# Altium schematic sheet HEADERSchDoc.SchDoc: HEADER
size 420 x 297 mm; SheetNumber: 3; SheetTotal: 11
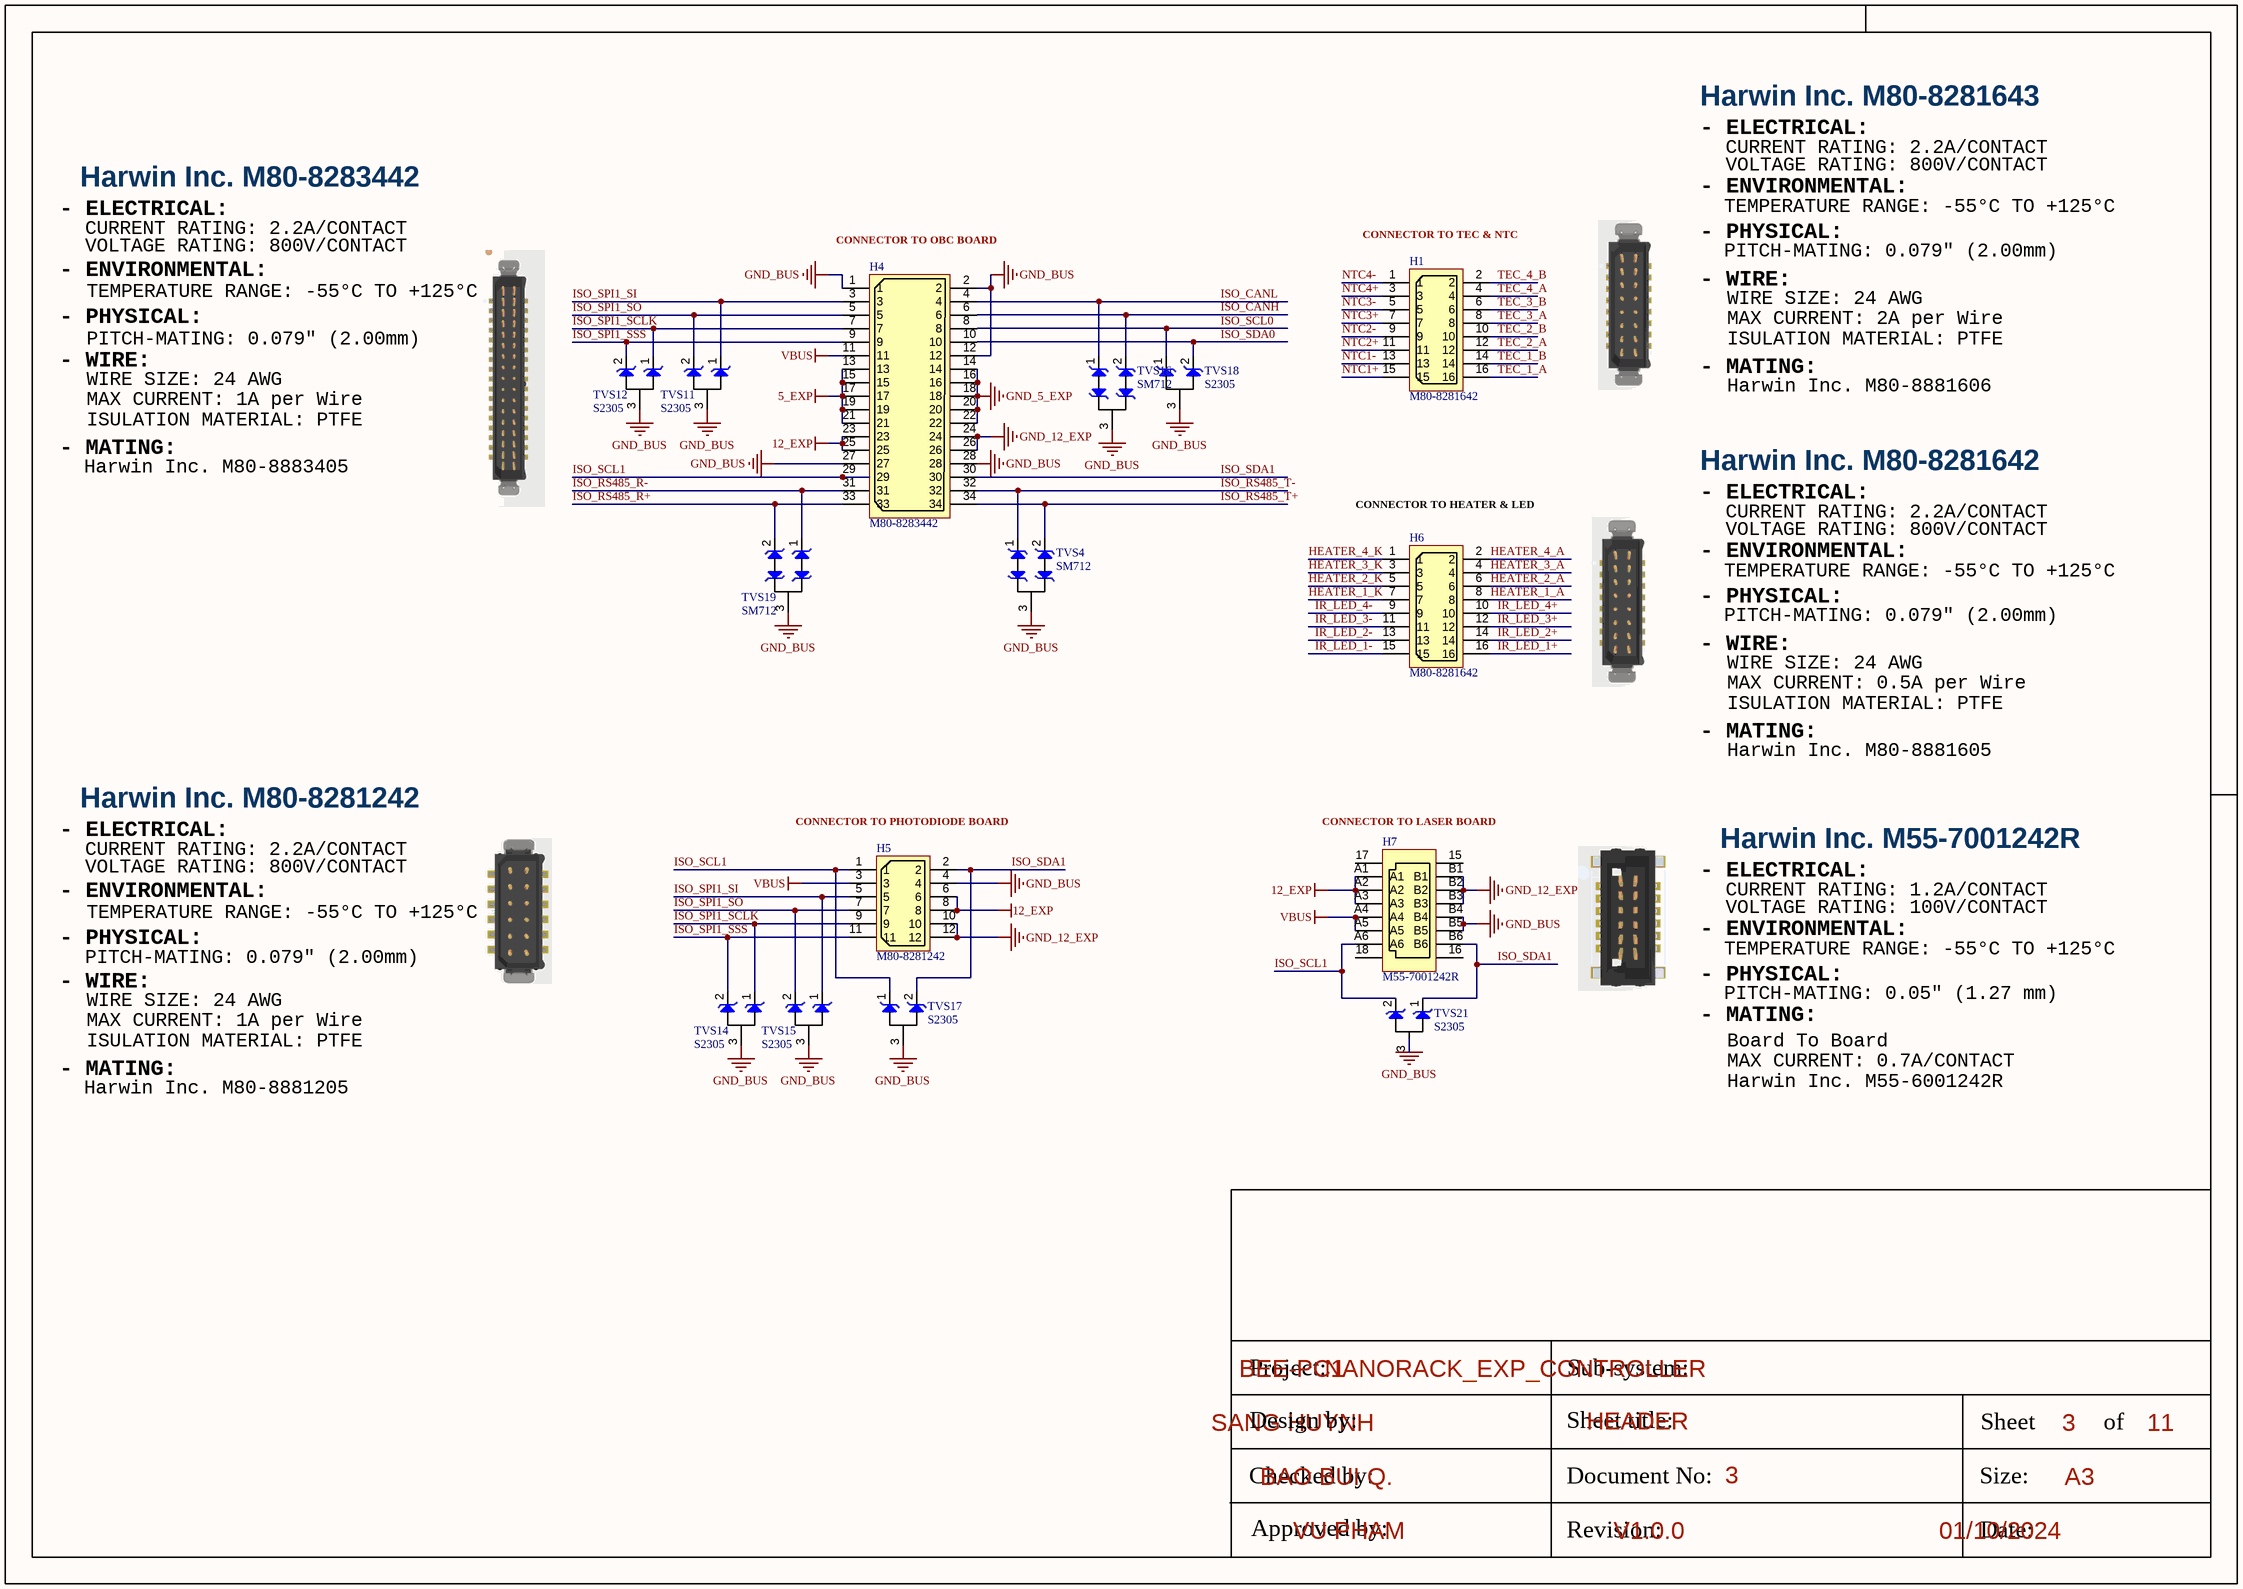
[diagram p0: HEADERSchDoc.SchDoc]

## Parts
H1  M80-8281642  [M80-8281642]
H4  M80-8283442  [M80-8283442]
H5  M80-8281242  [M80-8281242]
H6  M80-8281642  [M80-8281642]
H7  M55-7001242R  [M55-7001242R]
TVS4  SM712  [SOT23-12_3]
TVS11  S2305  [sot23-12_3]
TVS12  S2305  [sot23-12_3]
TVS14  S2305  [sot23-12_3]
TVS15  S2305  [sot23-12_3]
TVS16  SM712  [SOT23-12_3]
TVS17  S2305  [sot23-12_3]
TVS18  S2305  [sot23-12_3]
TVS19  SM712  [SOT23-12_3]
TVS21  S2305  [sot23-12_3]

## Nets
5_EXP: H4.13 H4.15 H4.17 H4.19 H4.21
12_EXP: H4.23 H4.25 H5.6 H5.8 H7.A1 H7.A2 H7.A3
GND_5_EXP: H4.14 H4.16 H4.18 H4.20 H4.22
GND_12_EXP: H4.24 H4.26 H5.10 H5.12 H7.B1 H7.B2 H7.B3
GND_BUS: H4.1 H4.2 H4.12 H4.27 H4.28 H5.4 H7.B4 H7.B5 TVS4.3 TVS11.3 TVS12.3 TVS14.3 TVS15.3 TVS16.3 TVS17.3 TVS18.3 TVS19.3 TVS21.3
VBUS: H4.11 H5.3 H7.A4 H7.A5
HEATER_1_A: H6.8
HEATER_1_K: H6.7
HEATER_2_A: H6.6
HEATER_2_K: H6.5
HEATER_3_A: H6.4
HEATER_3_K: H6.3
HEATER_4_A: H6.2
HEATER_4_K: H6.1
IR_LED_1+: H6.16
IR_LED_1-: H6.15
IR_LED_2+: H6.14
IR_LED_2-: H6.13
IR_LED_3+: H6.12
IR_LED_3-: H6.11
IR_LED_4+: H6.10
IR_LED_4-: H6.9
ISO_CANH: H4.6 TVS16.2
ISO_CANL: H4.4 TVS16.1
ISO_RS485_R+: H4.33 TVS19.2
ISO_RS485_R-: H4.31 TVS19.1
ISO_RS485_T+: H4.34 TVS4.2
ISO_RS485_T-: H4.32 TVS4.1
ISO_SCL0: H4.8 TVS18.1
ISO_SCL1: H4.29 H5.1 H7.A6 TVS17.1 TVS21.2
ISO_SDA0: H4.10 TVS18.2
ISO_SDA1: H4.30 H5.2 H7.B6 TVS17.2 TVS21.1
ISO_SPI1_~{SSS}: H4.9 H5.11 TVS12.2 TVS14.2
ISO_SPI1_SCLK: H4.7 H5.9 TVS12.1 TVS14.1
ISO_SPI1_SI: H4.3 H5.5 TVS11.1 TVS15.1
ISO_SPI1_SO: H4.5 H5.7 TVS11.2 TVS15.2
NTC1+: H1.15
NTC1-: H1.13
NTC2+: H1.11
NTC2-: H1.9
NTC3+: H1.7
NTC3-: H1.5
NTC4+: H1.3
NTC4-: H1.1
TEC_1_A: H1.16
TEC_1_B: H1.14
TEC_2_A: H1.12
TEC_2_B: H1.10
TEC_3_A: H1.8
TEC_3_B: H1.6
TEC_4_A: H1.4
TEC_4_B: H1.2

Not connected (* = marked no-connect by the designer): H7 15 16 17 18

## Notes on the sheet
- Harwin Inc. M80-8281643
- Harwin Inc. M80-8283442
- - ELECTRICAL:
- - ENVIRONMENTAL:
- CURRENT RATING: 2.2A/CONTACT
- VOLTAGE RATING: 800V/CONTACT
- (near H4) CONNECTOR TO OBC BOARD
- (near H1) CONNECTOR TO TEC & NTC
- - PHYSICAL:
- TEMPERATURE RANGE: -55°C TO +125°C
- PITCH-MATING: 0.079" (2.00mm)
- - WIRE:
- WIRE SIZE: 24 AWG
- MAX CURRENT: 2A per Wire
- - MATING:
- Harwin Inc. M80-8881606
- ISULATION MATERIAL: PTFE
- MAX CURRENT: 1A per Wire
- Harwin Inc. M80-8883405
- (near H6) CONNECTOR TO HEATER & LED
- Harwin Inc. M80-8281642
- MAX CURRENT: 0.5A per Wire
- Harwin Inc. M80-8881605
- Harwin Inc. M80-8281242
- (near H5) CONNECTOR TO PHOTODIODE BOARD
- (near H7) CONNECTOR TO LASER BOARD
- Harwin Inc. M55-7001242R
- CURRENT RATING: 1.2A/CONTACT
- VOLTAGE RATING: 100V/CONTACT
- PITCH-MATING: 0.05" (1.27 mm)
- Board To Board
- MAX CURRENT: 0.7A/CONTACT
- Harwin Inc. M80-8881205
- Harwin Inc. M55-6001242R
- Project:
- BEE-PC1
- Sub-system:
- NANORACK_EXP_CONTROLLER
- Design by:
- SANG HUYNH
- BAO BUI Q.
- Sheet title:
- Sheet
- A3
- of
- Checked by:
- Approved by:
- VU PHAM
- Revision:
- Document No:
- V1.0.0
- Size:
- Date:
- 01/10/2024

## Library data of the parts
H1 H6 = M80-8281642: CONN HEADER SMD 16POS 2MM
H4 = M80-8283442: CONN HEADER SMD 34POS 2MM
H5 = M80-8281242: CONN HEADER SMD 12POS 2MM
H7 = M55-7001242R: CONN HEADER SMD 12POS 1.27MM
TVS4 TVS16 TVS19 = SM712: 7V/12V TVS,PACKAGE SOT-23, TVS A
TVS11 TVS12 TVS14 TVS15 TVS17 TVS18 TVS21 = S2305: TVS DIODE 5VWM 10.8VC SOT23